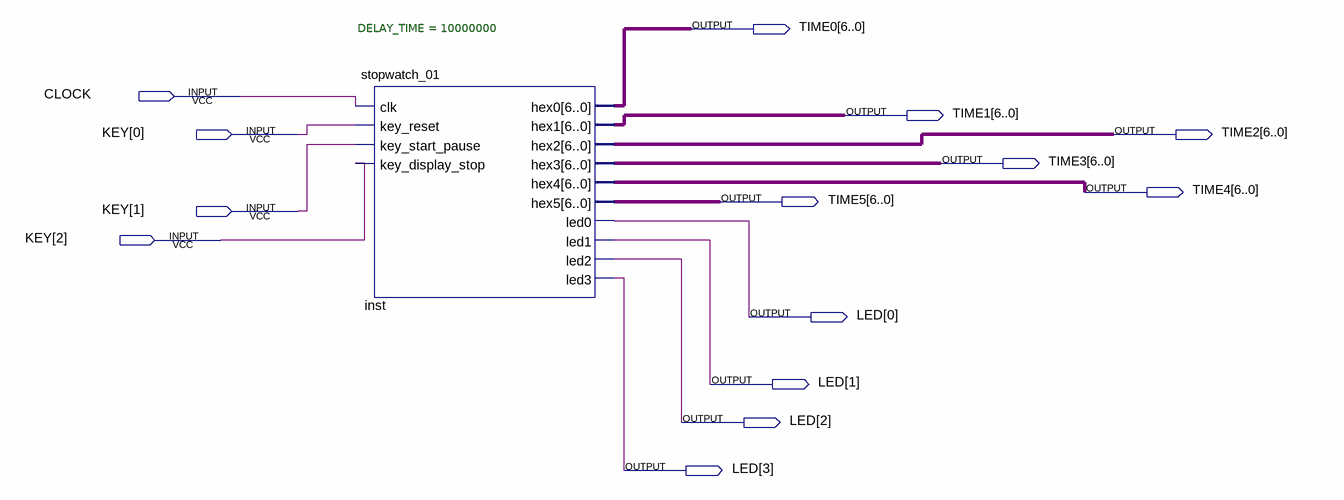
[diagram p0: schematic sheet]
// Quartus schematic secondClosk.bdf as structural Verilog: 1 symbols, 14 pins
module secondClosk (
  input  CLOCK,
  input  [2:0] KEY,
  output [6:0] TIME0,
  output [6:0] TIME1,
  output [6:0] TIME2,
  output [6:0] TIME3,
  output [6:0] TIME4,
  output [6:0] TIME5,
  output [3:0] LED
);

  stopwatch_01 #(.DELAY_TIME(10000000)) inst (
    .clk(CLOCK), .key_reset(KEY[0]), .key_start_pause(KEY[1]), .key_display_stop(KEY[2]), .hex0(TIME0),
    .hex1(TIME1), .hex2(TIME2), .hex3(TIME3), .hex4(TIME4), .hex5(TIME5), .led0(LED[0]), .led1(LED[1]),
    .led2(LED[2]), .led3(LED[3]));
endmodule
